# EAGLE design Backplane_Compact_R2_1 (EAGLE 6.6.0)
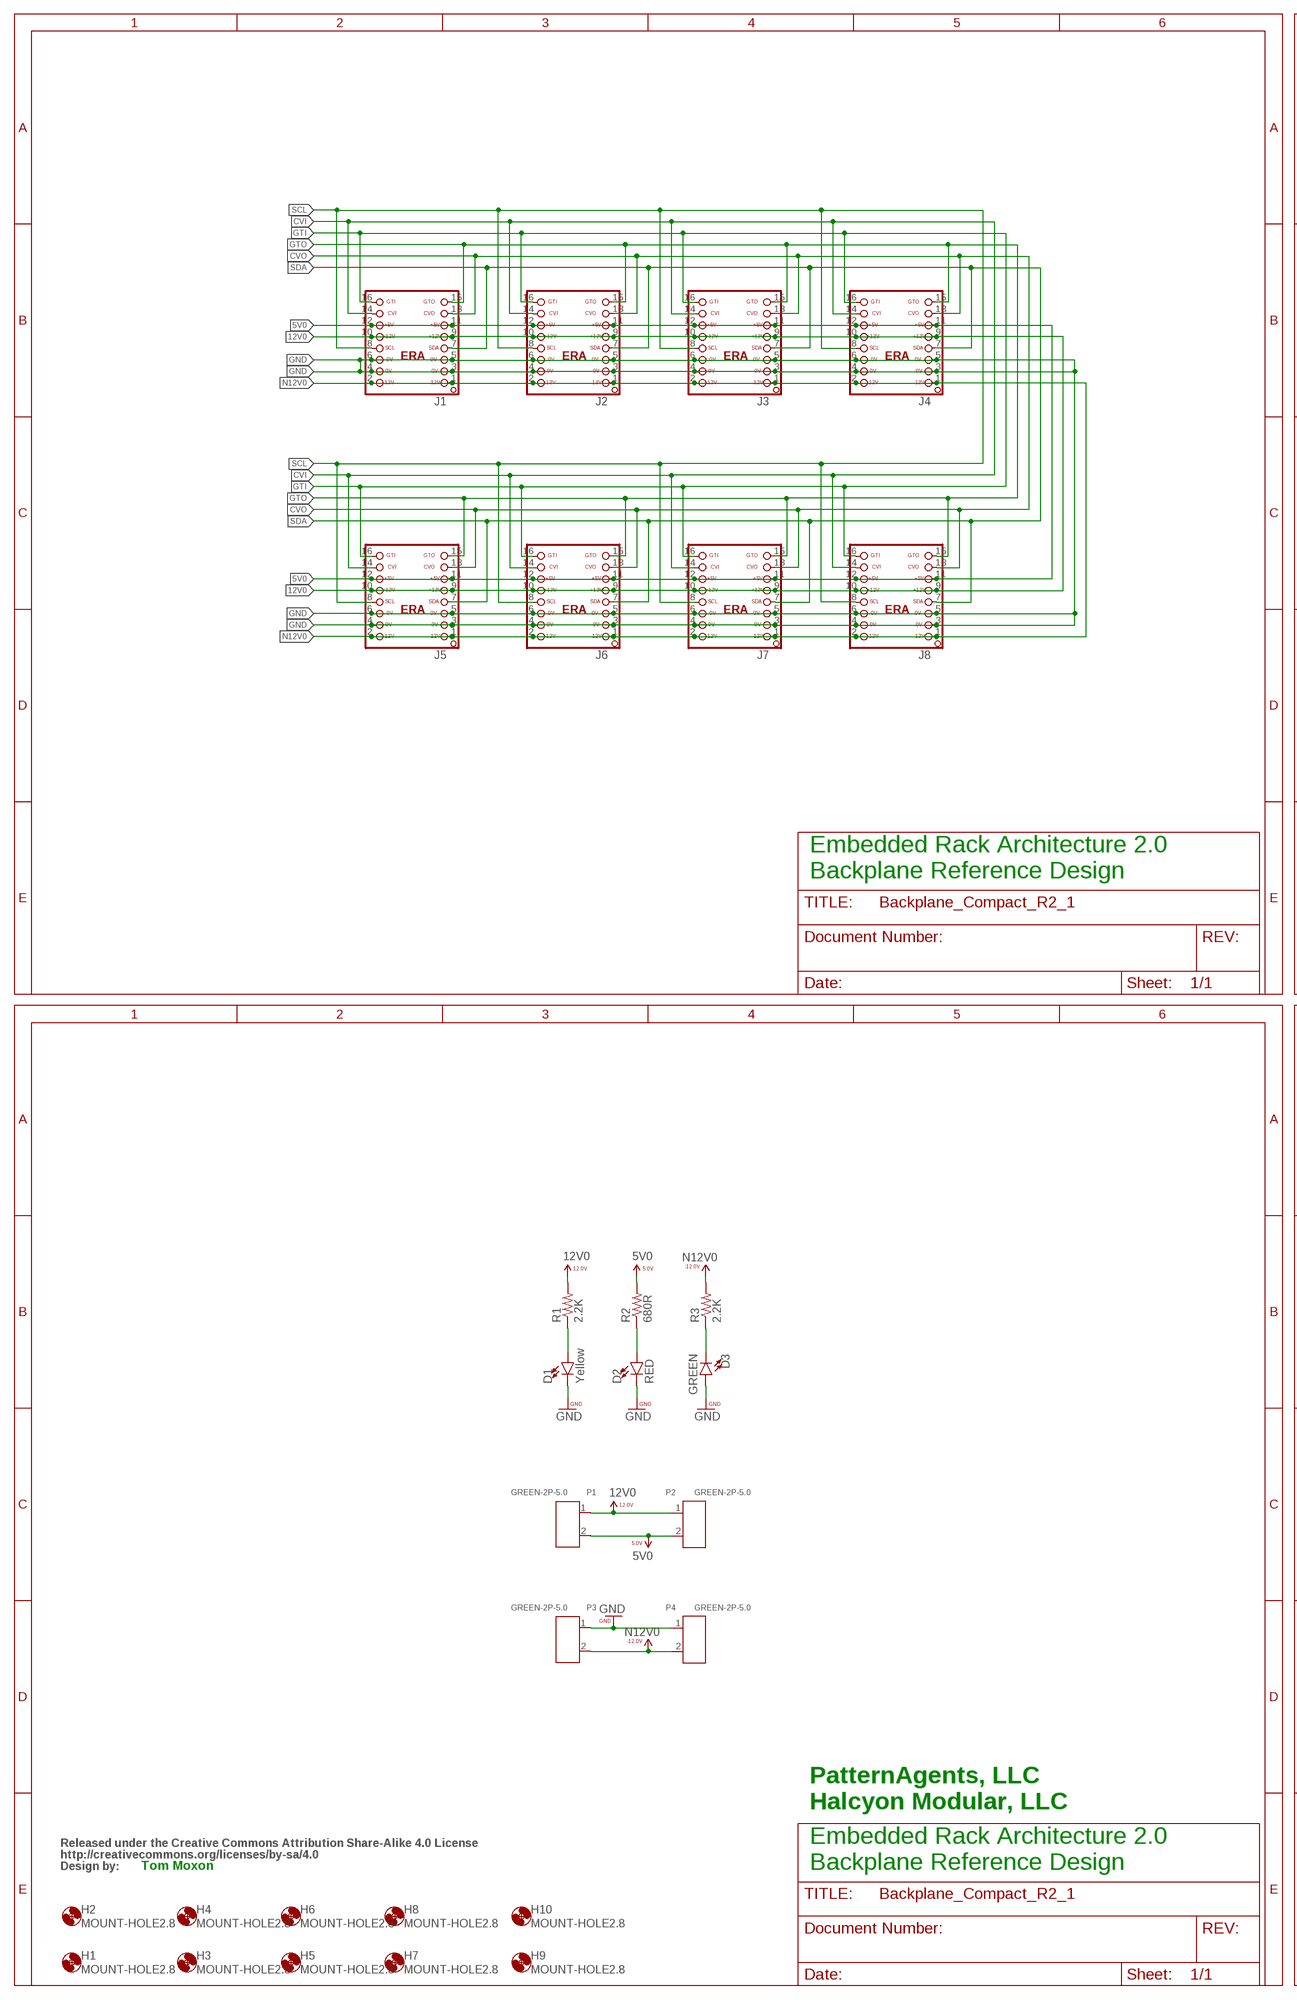
[diagram p0: schematic, sheet 1, part 1 of 2]
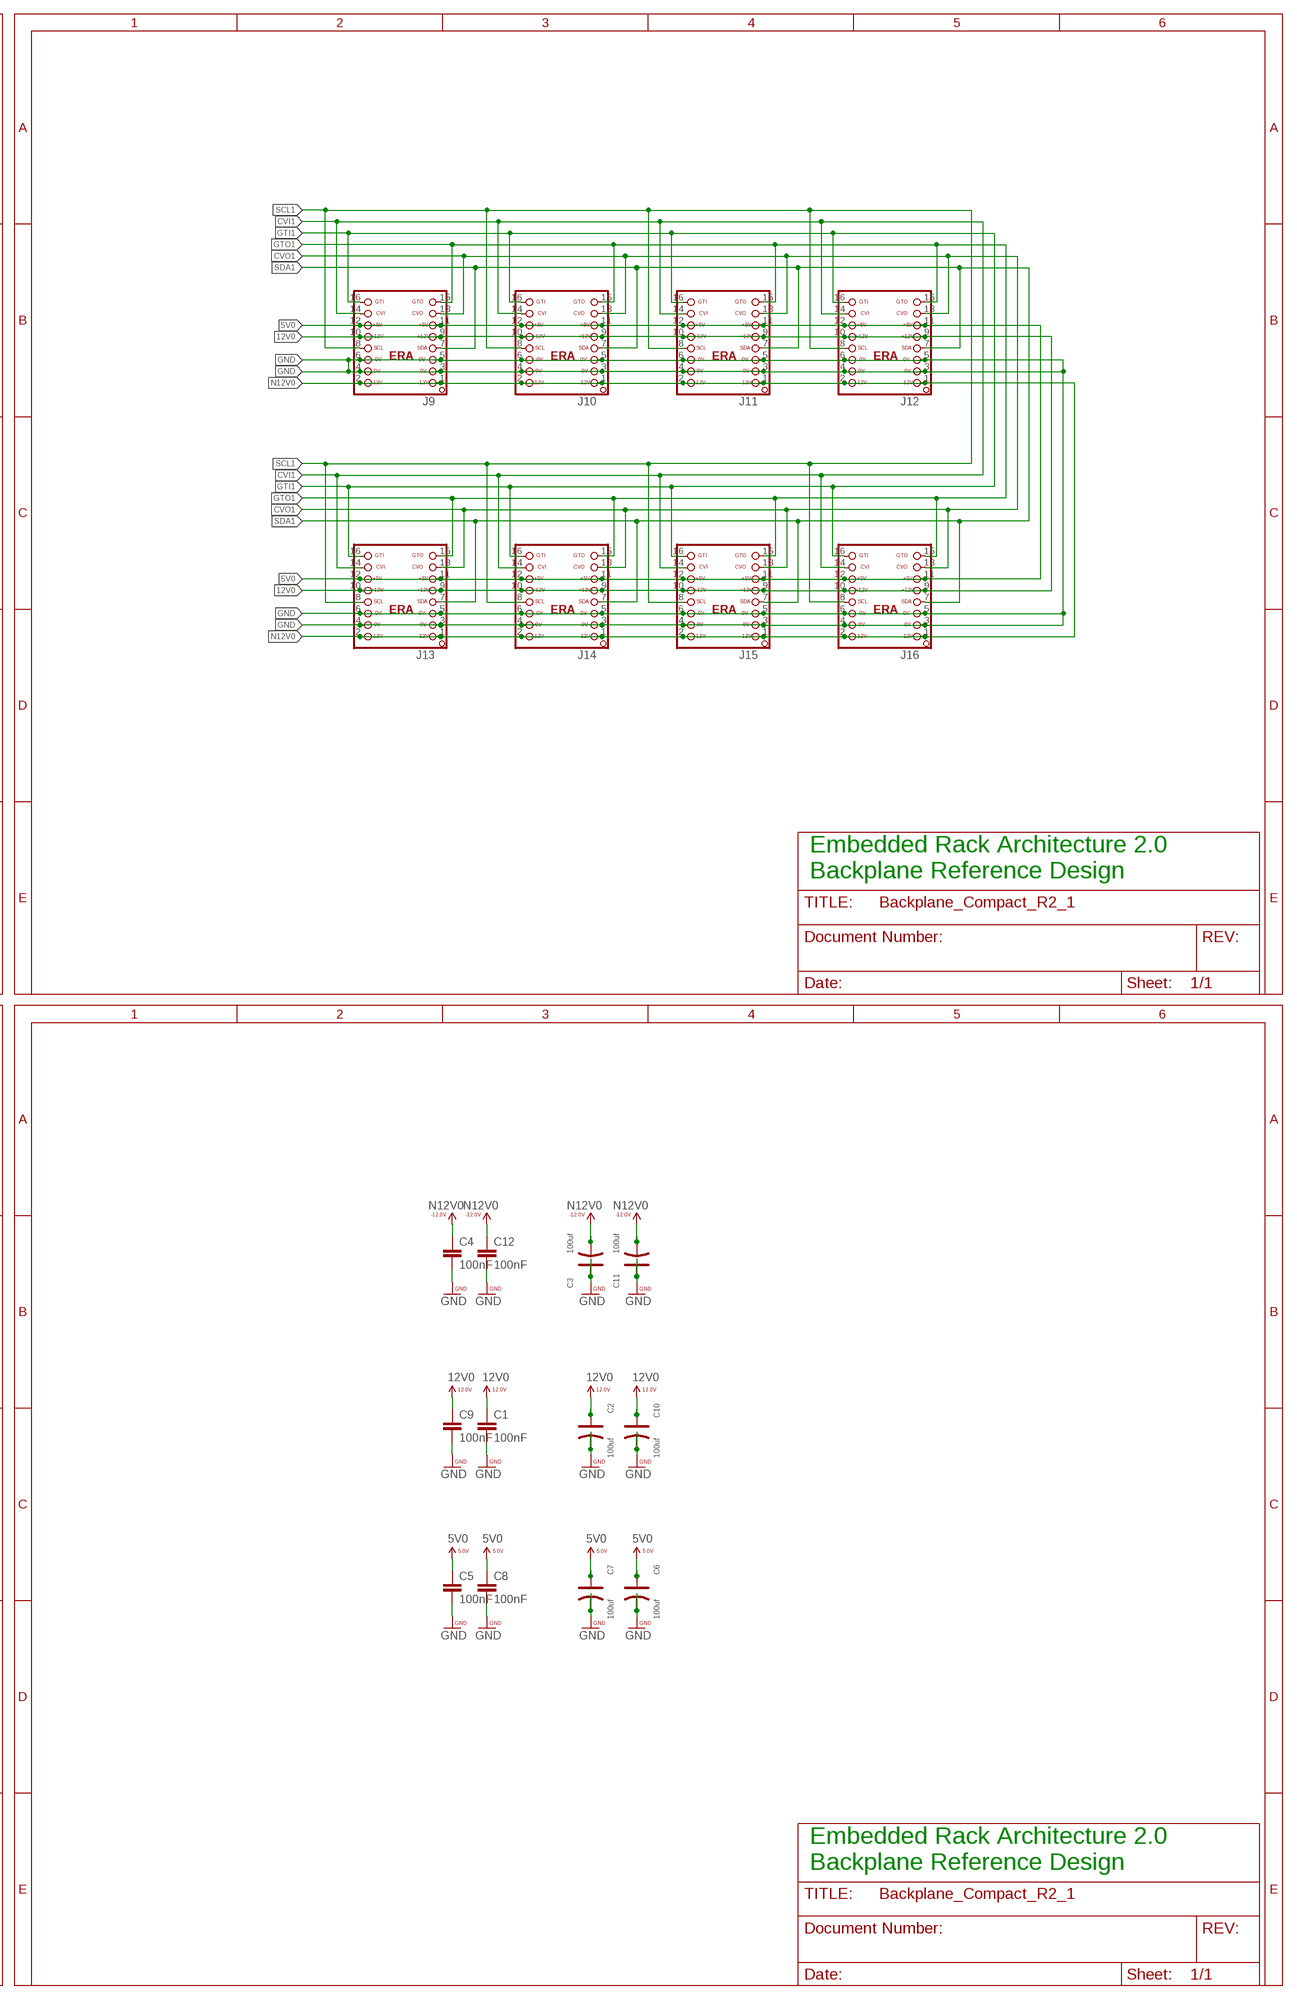
[diagram p1: schematic, sheet 1, part 2 of 2]

## Parts
C1  100nF  CAP0603-CAP  [0603-CAP]
C2  100uf  DIP-ALUMINUM-100UF-16V(D5-H7MM)  [PC-D5.3MM]
C3  100uf  DIP-ALUMINUM-100UF-16V(D5-H7MM)  [PC-D5.3MM]
C4  100nF  CAP0603-CAP  [0603-CAP]
C5  100nF  CAP0603-CAP  [0603-CAP]
C6  100uf  DIP-ALUMINUM-100UF-16V(D5-H7MM)  [PC-D5.3MM]
C7  100uf  DIP-ALUMINUM-100UF-16V(D5-H7MM)  [PC-D5.3MM]
C8  100nF  CAP0603-CAP  [0603-CAP]
C9  100nF  CAP0603-CAP  [0603-CAP]
C10  100uf  DIP-ALUMINUM-100UF-16V(D5-H7MM)  [PC-D5.3MM]
C11  100uf  DIP-ALUMINUM-100UF-16V(D5-H7MM)  [PC-D5.3MM]
C12  100nF  CAP0603-CAP  [0603-CAP]
D1  Yellow  LED-YELLOW0603  [LED-0603]
D2  RED  LED-RED0603  [LED-0603]
D3  GREEN  LED-GREEN0603  [LED-0603]
H1  MOUNT-HOLE2.8  [2,8]
H2  MOUNT-HOLE2.8  [2,8]
H3  MOUNT-HOLE2.8  [2,8]
H4  MOUNT-HOLE2.8  [2,8]
H5  MOUNT-HOLE2.8  [2,8]
H6  MOUNT-HOLE2.8  [2,8]
H7  MOUNT-HOLE2.8  [2,8]
H8  MOUNT-HOLE2.8  [2,8]
H9  MOUNT-HOLE2.8  [2,8]
H10  MOUNT-HOLE2.8  [2,8]
J1  ERA-SHROUD  [ERA]
J2  ERA-SHROUD  [ERA]
J3  ERA-SHROUD  [ERA]
J4  ERA-SHROUD  [ERA]
J5  ERA-SHROUD  [ERA]
J6  ERA-SHROUD  [ERA]
J7  ERA-SHROUD  [ERA]
J8  ERA-SHROUD  [ERA]
J9  ERA-SHROUD  [ERA]
J10  ERA-SHROUD  [ERA]
J11  ERA-SHROUD  [ERA]
J12  ERA-SHROUD  [ERA]
J13  ERA-SHROUD  [ERA]
J14  ERA-SHROUD  [ERA]
J15  ERA-SHROUD  [ERA]
J16  ERA-SHROUD  [ERA]
P1  GREEN-2P-5.0  SCREW-TERMINAL-GREEN(2P-5.0)  [H2-5.0-10.5X8.0MM]
P2  GREEN-2P-5.0  SCREW-TERMINAL-GREEN(2P-5.0)  [H2-5.0-10.5X8.0MM]
P3  GREEN-2P-5.0  SCREW-TERMINAL-GREEN(2P-5.0)  [H2-5.0-10.5X8.0MM]
P4  GREEN-2P-5.0  SCREW-TERMINAL-GREEN(2P-5.0)  [H2-5.0-10.5X8.0MM]
R1  2.2K  RESISTOR0603  [0603-RES]
R2  680R  RESISTOR0603  [0603-RES]
R3  2.2K  RESISTOR0603  [0603-RES]
U$48  BY_CC_SA_TEXTTEXT  [BY_CC_SA_TEXT]

## Nets
5V0: C5.1 C6.+ C7.+ C8.1 J1.11 J1.12 J2.11 J2.12 J3.11 J3.12 J4.11 J4.12 J5.11 J5.12 J6.11 J6.12 J7.11 J7.12 J8.11 J8.12 J9.11 J9.12 J10.11 J10.12 J11.11 J11.12 J12.11 J12.12 J13.11 J13.12 J14.11 J14.12 J15.11 J15.12 J16.11 J16.12 P1.2 P2.2 R2.2
12V0: C1.1 C2.+ C9.1 C10.+ J1.9 J1.10 J2.9 J2.10 J3.9 J3.10 J4.9 J4.10 J5.9 J5.10 J6.9 J6.10 J7.9 J7.10 J8.9 J8.10 J9.9 J9.10 J10.9 J10.10 J11.9 J11.10 J12.9 J12.10 J13.9 J13.10 J14.9 J14.10 J15.9 J15.10 J16.9 J16.10 P1.1 P2.1 R1.2
CVI: J1.14 J2.14 J3.14 J4.14 J5.14 J6.14 J7.14 J8.14
CVI1: J9.14 J10.14 J11.14 J12.14 J13.14 J14.14 J15.14 J16.14
CVO: J1.13 J2.13 J3.13 J4.13 J5.13 J6.13 J7.13 J8.13
CVO1: J9.13 J10.13 J11.13 J12.13 J13.13 J14.13 J15.13 J16.13
GND: C1.2 C2.- C3.+ C4.2 C5.2 C6.- C7.- C8.2 C9.2 C10.- C11.+ C12.2 D1.C D2.C D3.A J1.3 J1.4 J1.5 J1.6 J2.3 J2.4 J2.5 J2.6 J3.3 J3.4 J3.5 J3.6 J4.3 J4.4 J4.5 J4.6 J5.3 J5.4 J5.5 J5.6 J6.3 J6.4 J6.5 J6.6 J7.3 J7.4 J7.5 J7.6 J8.3 J8.4 J8.5 J8.6 J9.3 J9.4 J9.5 J9.6 J10.3 J10.4 J10.5 J10.6 J11.3 J11.4 J11.5 J11.6 J12.3 J12.4 J12.5 J12.6 J13.3 J13.4 J13.5 J13.6 J14.3 J14.4 J14.5 J14.6 J15.3 J15.4 J15.5 J15.6 J16.3 J16.4 J16.5 J16.6 P3.1 P4.1
GREEN: D3.C R3.1
GTI: J1.16 J2.16 J3.16 J4.16 J5.16 J6.16 J7.16 J8.16
GTI1: J9.16 J10.16 J11.16 J12.16 J13.16 J14.16 J15.16 J16.16
GTO: J1.15 J2.15 J3.15 J4.15 J5.15 J6.15 J7.15 J8.15
GTO1: J9.15 J10.15 J11.15 J12.15 J13.15 J14.15 J15.15 J16.15
N12V0: C3.- C4.1 C11.- C12.1 J1.1 J1.2 J2.1 J2.2 J3.1 J3.2 J4.1 J4.2 J5.1 J5.2 J6.1 J6.2 J7.1 J7.2 J8.1 J8.2 J9.1 J9.2 J10.1 J10.2 J11.1 J11.2 J12.1 J12.2 J13.1 J13.2 J14.1 J14.2 J15.1 J15.2 J16.1 J16.2 P3.2 P4.2 R3.2
RED: D2.A R2.1
SCL: J1.8 J2.8 J3.8 J4.8 J5.8 J6.8 J7.8 J8.8
SCL1: J9.8 J10.8 J11.8 J12.8 J13.8 J14.8 J15.8 J16.8
SDA: J1.7 J2.7 J3.7 J4.7 J5.7 J6.7 J7.7 J8.7
SDA1: J9.7 J10.7 J11.7 J12.7 J13.7 J14.7 J15.7 J16.7
YELLOW: D1.A R1.1

## Notes on the sheet
- Embedded Rack Architecture 2.0
  Backplane Reference Design
- Embedded Rack Architecture 2.0
  Backplane Reference Design
- PatternAgents, LLC
  Halcyon Modular, LLC
- Tom Moxon
- Embedded Rack Architecture 2.0
  Backplane Reference Design
- Embedded Rack Architecture 2.0
  Backplane Reference Design

## Library data of the parts
C1 C4 C5 C8 C9 C12 = PatternAgents-ProtoPads:CAP: Capacitor Standard 0603 ceramic capacitor, and 0.1" leaded capacitor.
C2 C3 C6 C7 C10 C11 = Seeed-Capacitor-2016:DIP-ALUMINUM-100UF-16V(D5-H7MM): 302030031; MPN: KS 100uF/16V
D1 = SparkFun-LED:LED-YELLOW: Yellow SMD LED Used in manufacturing several products at SparkFun. Packages: 0603 - SMD 0603 package[Product Link] <http://www.kingbrightusa.com/product.asp?catalog_name=LED&product_id=APT1608SYCK> 0603 -SMART - SMART SMD 0603 package (more efficient/more expensive) [Product Link] <http://www.osram-os.com/osram_os/en/products/product-catalog/led-light-emitting-diodes/smartled-0603/ly-l29k/index.jsp> LilyPad - SMD1206 package[Product Datasheet] <https://www.sparkfun.com/datasheets/DevTools/LilyPad/Q150YUS4.pdf> SparkFun Products: Blynk Board <https://www.sparkfun.com/products/13794> IOIO-OTG <https://www.sparkfun.com/products/13613> XBee Explorer Serial <https://www.sparkfun.com/products/13225>; PROD_ID: DIO-09003
D2 = SparkFun-LED:LED-RED: Red SMD LED Used in manufacturing of most products at SparkFun Packages: 0603 - SMD 0603 package [Product Link] <http://docs.avagotech.com/docs/AV02-0551EN> 0603 SMART - SMD 0603 SMART package ( more efficient and expensive)[Product Link] <http://www.osram-os.com/Graphics/XPic2/00077099_0.pdf> 1206 - SMD1206 package [Product Link] <https://www.sparkfun.com/datasheets/DevTools/LilyPad/Q150OVS4.pdff> SparkFun Products: Pro Mini 328 -5V <https://www.sparkfun.com/products/821> RedBoard <https://www.sparkfun.com/products/12757> IOIO-OTG <https://www.sparkfun.com/products/13613>; PROD_ID: DIO-00819
D3 = SparkFun-LED:LED-GREEN: Green SMD LED Used in manufacturing of various products at SparkFun Packages: 0603 - SMD 0603 package [Product Link] <http://www.futureelectronics.com/en/technologies/semiconductors/optoelectronics/leds/Pages/9894312-LTST-C190GKT.aspx?CrossPart=HSMG-C190&IM=0> LilyPad 1206 - SMD1206 LilyPad package [Product Link] <http://www.futureelectronics.com/en/Technologies/Product.aspx?ProductID=IN150NGHARVATEKCORPORATION2049943&IM=0> 1206 - SMD1206 package [Product Link] <http://www.futureelectronics.com/en/technologies/semiconductors/optoelectronics/leds/Pages/8315665-LTST-C150KGKT.aspx?IM=0> 1206 Bottom Mount -SMD 1206 Bottom Mount [Product Link] <http://www.digikey.com/product-detail/en/lite-on-inc/LTST-C230KGKT/160-1456-1-ND/386854> SparkFun Products: Pro Mini 328 -5V <https://www.sparkfun.com/products/821> RedBoard <https://www.sparkfun.com/products/12757> MP3 Trigger <https://www.sparkfun.com/products/13720> Makey Makey <https://www.sparkfun.com/products/11076>; PROD_ID: DIO-00821
H1-H10 = euro_rack:MOUNT-HOLE: MOUNTING HOLE with drill center marker
J1-J16 = ERA:ERA: EuroRack2 - Backplane Connector
P1-P4 = Seeed-Connector -2016:SCREW-TERMINAL-GREEN(2P-5.0): 320110031
R1-R3 = halcyonmod_Passives:RESISTOR: Resistor Basic schematic elements and footprints for 0603, 1206, and PTH resistors.
U$48 = PatternAgents-Logos:BY_CC_SA_TEXT: BY_CC_SA_TEXT Source : http://wiki.creativecommons.org/CC_markers Github : https://github.com/PatternAgents/PCB_Libraries License : http://creativecommons.org/licenses/by-sa/4.0/ (Creative Commons 4.0) THIS SOFTWARE IS PROVIDED BY THE CONTRIBUTORS "AS IS" AND WITHOUT ANY EXPRESS OR IMPLIED WARRANTIES, INCLUDING, BUT NOT LIMITED TO, THE IMPLIED WARRANTIES OF MERCHANTABILITY AND FITNESS FOR A PARTICULAR PURPOSE ARE DISCLAIMED. IN NO EVENT SHALL THE COPYRIGHT OWNER OR CONTRIBUTORS BE LIABLE FOR ANY DIRECT, INDIRECT, INCIDENTAL, SPECIAL, EXEMPLARY, OR CONSEQUENTIAL DAMAGES (INCLUDING, BUT NOT LIMITED TO, PROCUREMENT OF SUBSTITUTE GOODS OR SERVICES; LOSS OF USE, DATA, OR PROFITS; OR BUSINESS INTERRUPTION) HOWEVER CAUSED AND ON ANY THEORY OF LIABILITY, WHETHER IN CONTRACT, STRICT LIABILITY, OR TORT (INCLUDING NEGLIGENCE OR OTHERWISE) ARISING IN ANY WAY OUT OF THE USE OF THIS SOFTWARE, EVEN IF ADVISED OF THE POSSIBILITY OF SUCH DAMAGE.

## Board
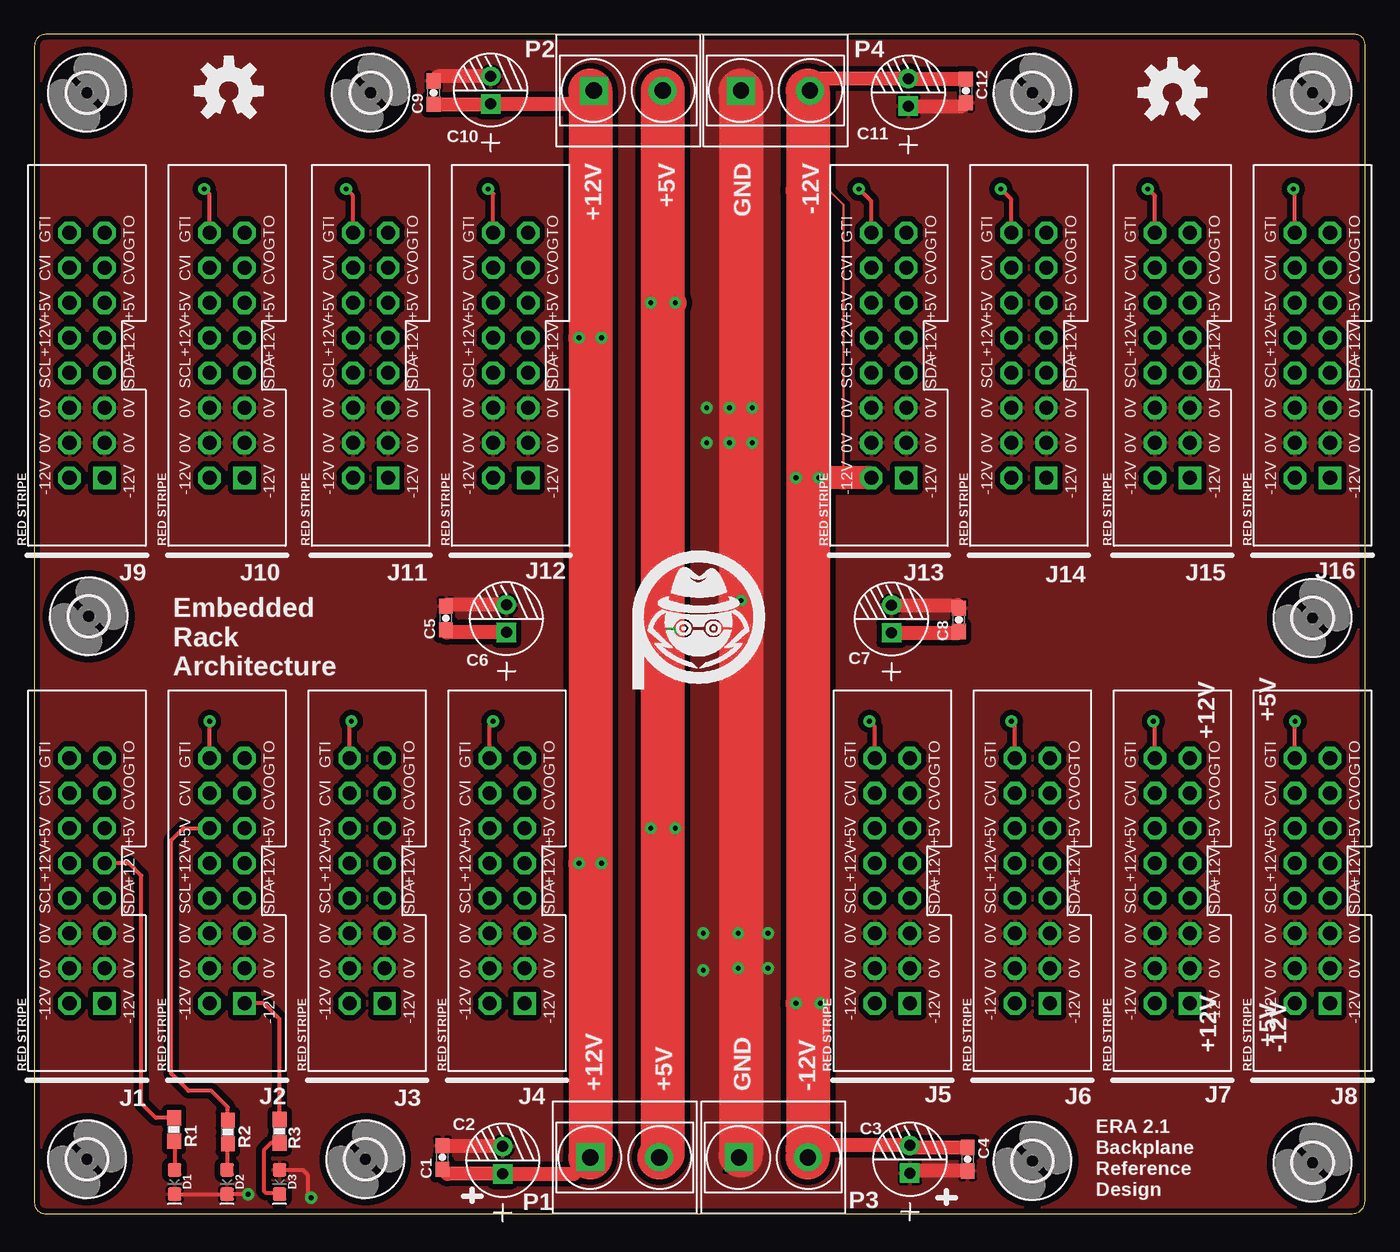
[diagram p2: board, top side]
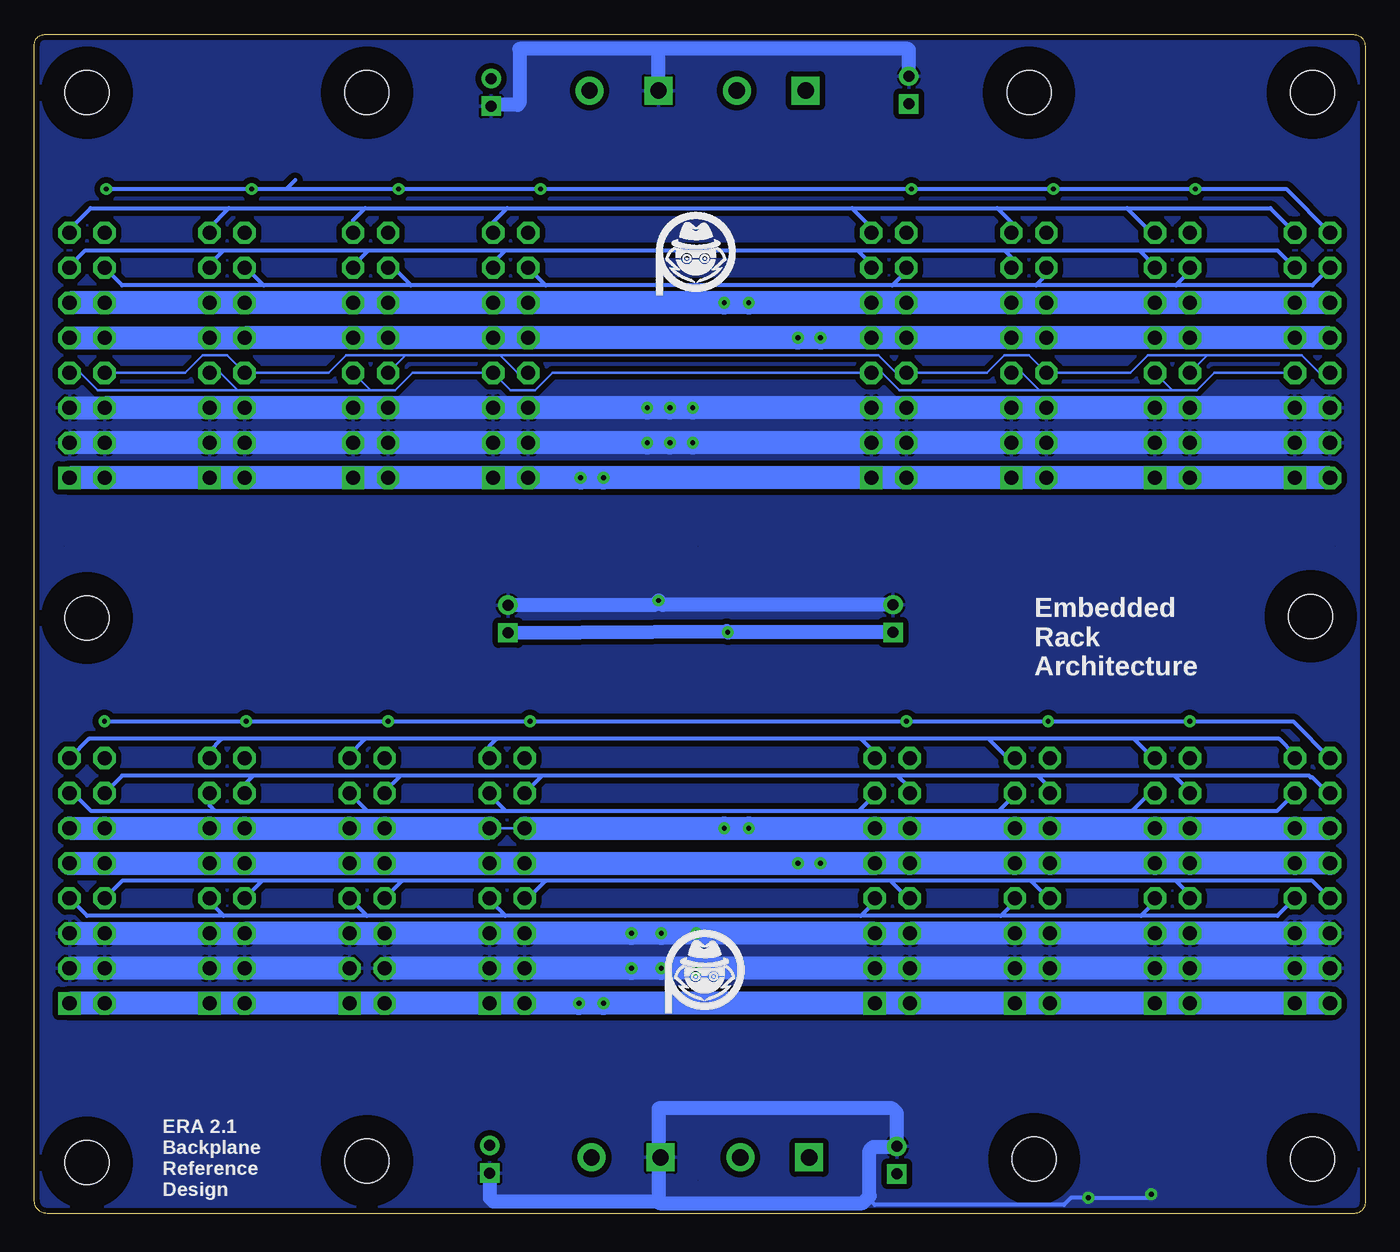
[diagram p3: board, bottom side, seen from below]

Size 96.52 x 85.5 mm. Coordinates in mm from the lower left corner, seen from the top.
Outline: 0,84.69 0,0.74 arc90 0.74,0 95.6,0 arc90 96.52,0.92 96.52,84.78 arc90 95.8,85.5 0.81,85.5 arc90 0,84.69
Copper layers (1*16): Top 0.035mm / dielectric 1.5mm / Bottom 0.035mm
Design rules "PatternAgents_7mil": minimum track width 7mil, minimum drill 14mil, track to track 7mil, track to pad 7mil, pad to pad 7mil, via to via 7mil, smd to smd 7mil, copper to edge 7mil, drill to drill 7mil, minimum pad ring 12mil, minimum via ring 10mil, stop-mask expansion 4mil, vias tented up to drill 25mil, thermal gap 7mil

### Footprints (pad centres in the part's own frame; a part is rotated, then mirrored left to right if it is on the bottom)
0603-CAP = smd 1.1 x 1: 1 -0.85,0; 2 0.85,0
PC-D5.3MM = drill 0.8 pad 1.35 square: + -1,0 | drill 0.8 pad 1.35: - 1,0
LED-0603 = smd 1 x 1: A -0.877,0; C 0.877,0
2,8 = hole 3.2: 0,0
ERA = drill 1.016 square: 1 -8.89,-1.27 | drill 1.016 octagon: 2 -8.89,1.27; 3 -6.35,-1.27; 4 -6.35,1.27; 5 -3.81,-1.27; 6 -3.81,1.27; 7 -1.27,-1.27; 8 -1.27,1.27; 9 1.27,-1.27; 10 1.27,1.27; 11 3.81,-1.27; 12 3.81,1.27; 13 6.35,-1.27; 14 6.35,1.27; 15 8.89,-1.27; 16 8.89,1.27
H2-5.0-10.5X8.0MM = drill 1.168 pad 2.032 square: 1 0,2.5 | drill 1.168 pad 2.032: 2 0,-2.5
0603-RES = smd 1.1 x 1: 1 -0.85,0; 2 0.85,0

### Placement (x,y rotation side)
C1  29.59,4.06 90 top
C2  33.97,3.87 90 top
C3  63.5,3.94 90 top
C4  67.69,3.94 270 top
C5  29.84,43.18 90 top
C6  34.23,43.14 90 top
C7  62.17,43.11 90 top
C8  67.06,43.05 90 top
C9  28.96,81.28 90 top
C10  33.09,81.47 90 top
C11  63.39,81.3 90 top
C12  67.56,81.41 270 top
D1  10.16,2.29 270 top
D2  13.97,2.29 270 top
D3  17.78,2.29 270 top
H1  3.81,3.94 0 top
H2  3.94,43.31 0 top
H3  92.71,3.68 0 top
H4  92.71,43.18 0 top
H5  24,3.94 0 top
H6  3.81,81.28 0 top
H7  72.39,3.81 0 top
H8  92.71,81.28 0 top
H9  24.38,81.28 0 top
H10  72.39,81.28 0 top
J1  3.81,24.13 90 top
J2  13.97,24.13 90 top
J3  24.13,24.13 90 top
J4  34.29,24.13 90 top
J5  62.23,24.13 90 top
J6  72.39,24.13 90 top
J7  82.55,24.13 90 top
J8  92.71,24.13 90 top
J9  3.81,62.23 90 top
J10  13.97,62.23 90 top
J11  24.38,62.23 90 top
J12  34.54,62.23 90 top
J13  61.98,62.23 90 top
J14  72.14,62.23 90 top
J15  82.55,62.23 90 top
J16  92.71,62.23 90 top
P1  42.82,4.06 90 top
P2  43.08,81.43 90 top
P3  53.6,4.06 90 top
P4  53.75,81.43 90 top
R1  10.13,6.09 90 top
R2  14.03,5.91 90 top
R3  17.78,5.97 90 top
U$7  [OSHW_LOGO_MED_SYM]  82.55,81.28 0 top
U$8  [OSHW_LOGO_MED_SYM]  82.55,81.28 0 top
U$9  [OSHW_LOGO_MED_SYM]  14.1,81.41 0 top
U$19  PA_LOGO_SYMMED  [PA_LOGO_AGENT_MED_SYM]  48.51,69.22 0 bottom
U$36  [OSHW_LOGO_MED_SYM]  14.1,81.41 0 top
U$37  PA_LOGO_SYMMED  [PA_LOGO_AGENT_MED_SYM]  47.88,17.14 0 bottom
U$38  PA_LOGO_SYMLARGE  [PA_LOGO_AGENT_LRG_SYM]  48.26,42.42 0 top
U$48  20.83,-7.87 0 top  (outside the outline)

### Tracks (layer width: path | path; a pad name or v marks a point on that pad's centre or on a via)
5V0  (via drill 0.36)
  Top 0.178: 45.58,26.42 45.72,26.42 45.58,27.94 v46.48,27.94 | 45.58,65.28 45.72,65.28 45.72,66.04 | v46.23,42.16 45.58,42.16
  Top 0.305: R2.2 14.03,7.69 12.83,8.89 11.18,8.89 9.91,10.16 9.91,27.05 10.79,27.94 J2.12
  Top 1.016: C6.+ 29.91,42.14 C5.1 | C7.+ 66.97,42.11 C8.1
  Top 1.676: v46.48,66.04 45.72,66.04 44.83,66.04
  Top 3.175: P2.2 45.58,65.28 45.58,42.16 45.58,27.94 | 45.58,27.69 45.58,26.42 45.58,4.32 P1.2
  Bottom 0.178: J5.12 J5.11
  Bottom 1.016: C7.+ 46.3,42.24 v46.23,42.16 46.21,42.14 C6.+
  Bottom 1.676: J8.11 J8.12 J7.11 J7.12 J6.11 J6.12 J5.11 | J1.12 J1.11 J2.12 J2.11 J3.12 J3.11 J4.12 J4.11 v44.7,27.94 v46.48,27.94 J5.12 | J9.12 J9.11 J10.12 J10.11 J11.12 J11.11 J12.12 J12.11 v44.7,66.04 v46.48,66.04 J13.12 J13.11 J14.12 J14.11 J15.12 J15.11 J16.12 J16.11
12V0  (via drill 0.36)
  Top 0.178: v39.5,25.4 40.32,25.4 | v39.5,63.5 40.32,63.5
  Top 0.305: R1.2 8.8,6.94 7.75,8 7.75,24.51 6.86,25.4 J1.9
  Top 1.016: P2.1 39.61,80.47 C10.+ 33.05,80.43 C9.1 | C1.1 29.93,2.87 C2.+ 39.13,2.87 P1.1
  Top 2.184: P2.1 40.32,81.43
  Top 3.175: 40.32,81.43 40.32,63.5 40.32,25.4 P1.1
  Bottom 0.178: 39.88,3.81 40.13,4.06 P1.1 | 40.13,81.03 40.39,81.28 P2.1
  Bottom 1.676: J1.10 J1.9 J2.10 J2.9 J3.10 J3.9 J4.10 J4.9 v39.5,25.4 v41.15,25.4 J5.10 J5.9 J6.10 J6.9 J7.10 J7.9 J8.10 J8.9 | J9.10 J9.9 J10.10 J10.9 J11.10 J11.9 J12.10 J12.9 v39.5,63.5 v41.15,63.5 J13.10 J13.9 J14.10 J14.9 J15.10 J15.9 J16.10 J16.9
CVI
  Bottom 0.305: J1.14 2.67,30.48 3.81,31.62 3.94,31.62 4.06,31.75 13.84,31.75 | 13.84,31.75 23.75,31.75 | 23.75,31.75 33.91,31.75 | 33.91,31.75 59.69,31.75 | 59.69,31.75 69.98,31.75 | 69.98,31.75 80.64,31.75 | 80.64,31.75 90.17,31.75 J8.14 | J7.14 81.28,31.11 80.64,31.75 | J6.14 71.12,30.61 69.98,31.75 | J5.14 59.69,31.75 | J2.14 12.7,30.61 13.84,31.75 | J3.14 22.86,30.86 23.75,31.75 | J4.14 33.02,30.86 33.91,31.75
CVI1
  Bottom 0.305: J9.14 3.81,67.31 13.72,67.31 | 13.72,67.31 23.88,67.31 | 23.88,67.31 34.29,67.31 | 34.29,67.31 59.44,67.31 | 59.44,67.31 69.22,67.31 | 69.22,67.31 79.88,67.31 | 79.88,67.31 90.17,67.31 J16.14 | J10.14 12.7,68.33 13.72,67.31 | J11.14 23.11,68.07 23.88,67.31 | J12.14 33.27,68.33 34.29,67.31 | J13.14 59.44,67.31 | J14.14 70.48,68.58 69.22,67.31 | J15.14 81.15,68.58 79.88,67.31
CVO
  Bottom 0.305: J8.13 93.73,30.48 92.46,29.21 83.44,29.21 | 83.44,29.21 72.39,29.21 | 72.39,29.21 62.36,29.21 | 62.36,29.21 36.7,29.21 | 36.7,29.21 26.54,29.21 | 26.54,29.21 16.89,29.21 | 16.89,29.21 6.35,29.21 J1.13 | J7.13 83.82,29.59 83.44,29.21 | J6.13 72.39,29.21 | J5.13 63.5,30.35 62.36,29.21 | J2.13 15.62,30.48 16.89,29.21 | J3.13 25.4,30.35 26.54,29.21 | J4.13 35.56,30.35 36.7,29.21
CVO1
  Bottom 0.305: J16.13 93.98,68.71 92.84,69.85 82.8,69.85 | 82.8,69.85 72.26,69.85 | 72.26,69.85 62.36,69.85 | 62.36,69.85 36.83,69.85 | 36.83,69.85 26.16,69.85 | 26.16,69.85 16.38,69.85 | 16.38,69.85 6.35,69.85 J9.13 | J10.13 15.24,68.71 16.38,69.85 | J11.13 25.65,69.34 26.16,69.85 | J12.13 35.81,68.83 36.83,69.85 | J13.13 63.25,68.96 62.36,69.85 | J14.13 73.41,68.71 72.26,69.85 | J15.13 83.82,68.83 82.8,69.85
GND  (via drill 0.36)
  Top 0.305: D3.A 19.44,3.16 19.81,2.79 19.81,1.4 | v15.49,1.4 13.98,1.4 D2.C D1.C
  Top 1.016: C10.- 29.29,82.47 C9.2 | C11.+ 67.31,80.3 C12.2 | C2.- 29.64,4.87 C1.2 | C4.2 63.65,3.09 C3.+ | C6.- 29.96,44.14 C5.2 | C7.- 66.97,44.11 C8.2
  Top 3.175: P4.1 v51.25,44.45 51.25,4.22
  Bottom 0.305: v15.49,1.4 15.75,1.14 v20.07,1.14 21.34,1.14 21.84,0.64 35.56,0.64 36.07,1.14
  Bottom 1.016: C10.- 33.09,84.4 33.15,84.45 51.05,84.45 | 51.05,84.45 61.34,84.45 61.34,80.52 61.47,80.39 63.3,80.39 C11.+ | P4.1 51.25,84.26 51.05,84.45 | 51.25,4.22 51.25,0.83 | 51.25,0.83 51.18,0.76 36.45,0.76 36.07,1.14 35.94,1.27 35.94,4.57 35.69,4.83 34.02,4.83 C2.- 33.97,7.3 34.29,7.62 51.25,7.62 51.25,4.22 | C3.+ 63.5,1.14 63.25,0.89 51.31,0.89 51.25,0.83 | C7.- 62.14,44.14 51.56,44.14 v51.25,44.45 50.94,44.14 C6.- | 51.25,4.22 P3.1
  Bottom 1.676: J1.4 J1.3 J2.4 J2.3 J3.4 J3.3 J4.4 J4.3 v51.05,17.78 v53.21,17.78 J5.4 J5.3 J6.4 | J6.3 J7.4 J7.3 J8.4 J8.3 | J8.6 J8.5 J7.5 J7.6 J6.5 J6.6 J5.5 J5.6 v53.21,20.32 v51.05,20.32 v48.51,20.32 J4.5 J4.6 J3.5 J3.6 J2.5 J2.6 J1.5 J1.6 | J9.4 J9.3 J10.4 J10.3 J11.4 J11.3 J12.4 J12.3 v48.77,55.88 v50.42,55.88 v52.07,55.88 J13.4 J13.3 J14.4 J14.3 J15.4 J15.3 J16.4 J16.3 | J16.5 J16.6 J15.5 J15.6 J14.5 J14.6 J13.5 J13.6 v52.07,58.42 v50.42,58.42 v48.77,58.42 J12.5 J12.6 J11.5 J11.6 J10.5 J10.6 J9.5 J9.6
  other vias: 48.51,17.65
  pour Top (isolate 0.406, hatched): 0,0 0,85.5 96.52,85.5 96.52,0
  pour Bottom (isolate 0.406, hatched): 0,0 0,85.5 96.52,85.5 96.52,0
GREEN
  Top 0.305: R3.1 17.18,5.12 16.64,4.57 16.64,1.65 16.76,1.52 17.66,1.52 D3.C
GTI  (via drill 0.36)
  Top 0.305: J8.16 v91.44,35.69 | J2.16 v12.7,35.69 | J5.16 60.96,35.31 v60.58,35.69 | J3.16 22.86,35.56 v22.99,35.69 | J4.16 33.02,35.43 v33.27,35.69 | J7.16 81.28,35.56 v81.15,35.69 | J6.16 71.12,35.43 v70.87,35.69
  Bottom 0.305: v91.44,35.69 v81.15,35.69 v70.87,35.69 v60.58,35.69 v33.27,35.69 v22.99,35.69 v12.7,35.69 5.21,35.69 J1.16
GTI1  (via drill 0.36)
  Top 0.305: J16.16 91.44,74.17 v91.31,74.3 | J13.16 60.71,73.41 v59.82,74.3 | J14.16 70.87,73.53 v70.1,74.3 | J15.16 81.28,73.79 v80.77,74.3 | J12.16 33.27,73.91 v32.89,74.3 | J11.16 23.11,73.79 v22.61,74.3 | J10.16 12.7,73.91 v12.32,74.3
  Bottom 0.305: v91.31,74.3 v80.77,74.3 | v80.77,74.3 v70.1,74.3 v59.82,74.3 v32.89,74.3 v22.61,74.3 v12.32,74.3 5.71,74.3 J9.16 | v80.77,74.3 78.23,74.3 77.6,74.93
GTO
  Bottom 0.305: J1.15 5.08,33.27 6.22,34.42 16.76,34.42 | 16.76,34.42 27.3,34.42 | 27.3,34.42 36.58,34.42 | 36.58,34.42 62.99,34.42 | 62.99,34.42 72.52,34.42 | 72.52,34.42 82.93,34.42 | 82.93,34.42 92.58,34.42 J8.15 | J3.15 25.91,33.02 27.3,34.42 | J4.15 35.56,33.4 36.58,34.42 | J2.15 15.37,33.02 16.76,34.42 | J5.15 63.5,33.91 62.99,34.42 | J6.15 73.66,33.27 72.52,34.42 | J7.15 83.82,33.53 82.93,34.42
GTO1
  Bottom 0.305: J16.15 93.98,71.37 92.46,72.9 82.42,72.9 | 82.42,72.9 72.52,72.9 | 72.52,72.9 62.23,72.9 | 62.23,72.9 37.21,72.9 | 37.21,72.9 26.67,72.9 | 26.67,72.9 17.27,72.9 | 17.27,72.9 6.86,72.9 J9.15 | J10.15 15.49,71.12 17.27,72.9 | J11.15 25.65,71.88 26.67,72.9 | J12.15 35.81,71.5 37.21,72.9 | J15.15 83.82,71.5 82.42,72.9 | J14.15 73.41,72.01 72.52,72.9 | J13.15 63.25,71.88 62.23,72.9
N12V0  (via drill 0.36)
  Top 0.178: v57.02,15.24 56.1,15.24 | 58.67,53.34 58.67,73.15 57.66,74.17 56.1,74.17
  Top 0.305: R3.2 17.78,14.1 16.64,15.24 J2.1
  Top 1.016: C12.1 67.52,82.3 C11.- 57.12,82.3 P4.2 | C4.1 63.65,4.79 C3.- 56.34,4.94 56.1,4.7
  Top 1.676: J13.2 58.67,53.34 v56.9,53.34
  Top 2.184: P4.2 56.1,81.43
  Top 3.175: 56.1,81.43 56.1,74.17 56.1,15.24 56.1,4.7 P3.2
  Bottom 0.178: 56.39,3.81 56.13,4.06 P3.2 | 56.39,81.28 P4.2
  Bottom 1.676: J1.2 J1.1 J2.2 J2.1 J3.2 J3.1 J4.2 J4.1 v55.24,15.24 v57.02,15.24 J5.2 J5.1 J6.2 J6.1 J7.2 J7.1 J8.2 J8.1 | J9.2 J9.1 J10.2 J10.1 J11.2 J11.1 J12.2 J12.1 v55.24,53.34 v56.9,53.34 J13.2 J13.1 J14.2 J14.1 J15.2 J15.1 J16.2 J16.1
RED
  Top 0.178: 13.97,4.83 R2.1
  Top 0.305: 13.97,4.83 D2.A
SCL
  Bottom 0.305: J1.8 3.81,24.13 13.72,24.13 | 13.72,24.13 24.26,24.13 | 24.26,24.13 34.42,24.13 | 34.42,24.13 59.44,24.13 | 59.44,24.13 69.85,24.13 | 69.85,24.13 80.01,24.13 | 80.01,24.13 90.17,24.13 J8.8 | J7.8 80.01,24.13 | J6.8 69.85,24.13 | J5.8 60.71,22.86 59.44,24.13 | J2.8 12.7,23.11 13.72,24.13 | J3.8 22.99,22.86 24.26,24.13 | J4.8 33.15,22.86 34.42,24.13
SCL1
  Bottom 0.178: J9.8 3.3,60.96 4.57,62.23 11.43,62.23 | J10.8 11.43,62.23 | 11.43,62.23 15.75,62.23 17.02,60.96 J11.8 24.38,62.23 26.16,62.23 27.43,60.96 J12.8 34.04,60.96 35.31,62.23 62.74,62.23 | J13.8 61.47,60.96 62.74,62.23 | 69.6,62.23 62.74,62.23 | J14.8 69.6,62.23 | 69.6,62.23 73.91,62.23 75.18,60.96 J15.8 82.55,62.23 84.33,62.23 85.6,60.96 J16.8
SDA
  Bottom 0.305: J1.7 6.35,21.59 16.26,21.59 | 16.26,21.59 26.42,21.59 | 26.42,21.59 36.58,21.59 | 36.58,21.59 62.36,21.59 | 62.36,21.59 72.39,21.59 | 72.39,21.59 82.8,21.59 | 82.8,21.59 92.71,21.59 J8.7 | J2.7 15.24,22.61 16.26,21.59 | J3.7 25.4,22.61 26.42,21.59 | J4.7 35.56,22.61 36.58,21.59 | J5.7 63.5,22.73 62.36,21.59 | J6.7 72.39,21.59 | J7.7 83.82,22.61 82.8,21.59
SDA1
  Bottom 0.178: J9.7 10.92,60.96 12.19,59.69 13.97,59.69 | J10.7 13.97,59.69 | J11.7 24.89,60.96 23.62,59.69 | 13.97,59.69 23.62,59.69 | 23.62,59.69 33.78,59.69 35.05,60.96 J12.7 58.93,60.96 60.2,59.69 61.98,59.69 J13.7 69.09,60.96 70.36,59.69 72.14,59.69 | J14.7 72.14,59.69 | J15.7 83.06,60.96 81.79,59.69 | 72.14,59.69 81.79,59.69 | J16.7 93.22,60.96 91.95,59.69 81.79,59.69
YELLOW
  Top 0.305: R1.1 10.16,5.22 D1.A

### Text on the board
tPlace: +12V | +5V | GND | -12V | Embedded / Rack / Architecture | +5V | +12V | +12V | +5V | -12V | +12V | +5V | GND | -12V | ERA 2.1 / Backplane / Reference / Design
bPlace: Embedded / Rack / Architecture | ERA 2.1 / Backplane / Reference / Design
tDocu: Tom Moxon